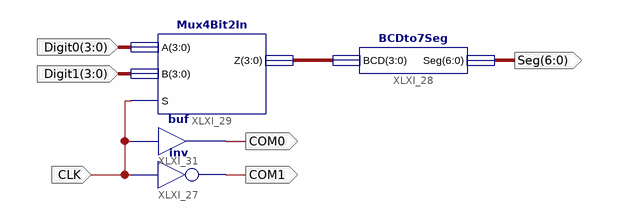
[diagram p0: schematic sheet 1]
// Xilinx ISE schematic BCDto7Seg2Digit.sch (spartan6) as structural Verilog: 4 symbols, 6 ports
module BCDto7Seg2Digit (
  input  [3:0] Digit0,
  input  [3:0] Digit1,
  input  CLK,
  output COM1,
  output COM0,
  output [6:0] Seg
);

  wire [3:0] XLXN_64;

  Mux4Bit2In XLXI_29 (.S(CLK), .B(Digit1), .A(Digit0), .Z(XLXN_64));
  not XLXI_27 (COM1, CLK);
  buf XLXI_31 (COM0, CLK);
  BCDto7Seg XLXI_28 (.BCD(XLXN_64), .Seg(Seg));
endmodule
